# Altium schematic sheet ADS_ExG.SchDoc: ADS_ExG
size A; DrawnBy: Tai Le; Revision: Ver01
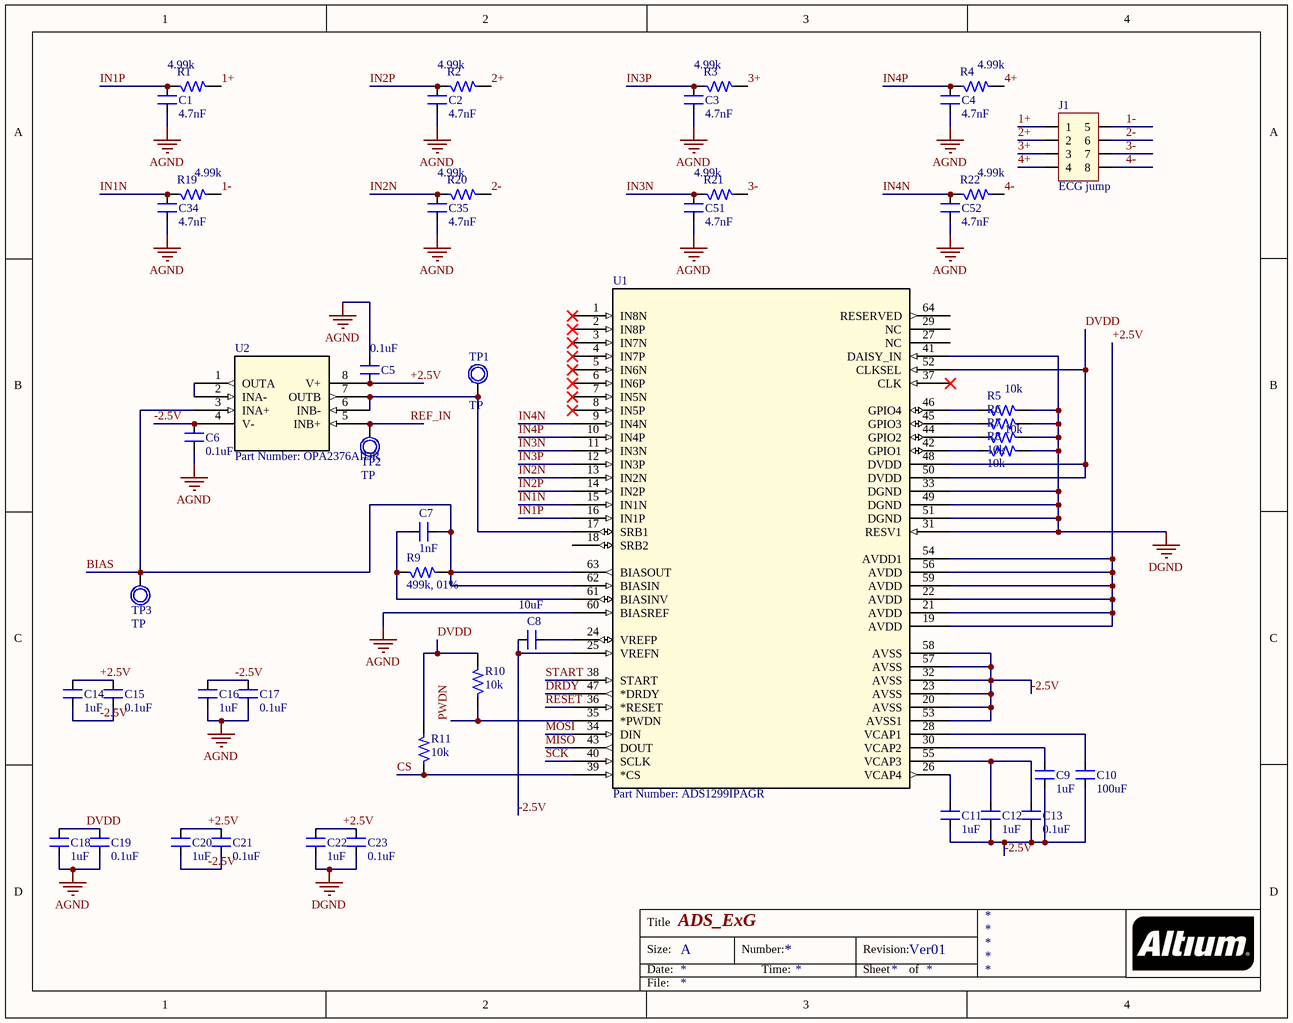
[diagram p0: ADS_ExG.SchDoc]

## Parts
C1  4.7nF  [SM-0805]
C2  4.7nF  [SM-0805]
C3  4.7nF  [SM-0805]
C4  4.7nF  [SM-0805]
C5  0.1uF  [SM-0805]
C6  0.1uF  [SM-0805]
C7  1nF  [SM-0805]
C8  10uF  [SM-0805]
C9  1uF  [SM-0805]
C10  100uF  [SM-0805]
C11  1uF  [SM-0805]
C12  1uF  [SM-0805]
C13  0.1uF  [SM-0805]
C14  1uF  [SM-0805]
C15  0.1uF  [SM-0805]
C16  1uF  [SM-0805]
C17  0.1uF  [SM-0805]
C18  1uF  [SM-0805]
C19  0.1uF  [SM-0805]
C20  1uF  [SM-0805]
C21  0.1uF  [SM-0805]
C22  1uF  [SM-0805]
C23  0.1uF  [SM-0805]
C34  4.7nF  [SM-0805]
C35  4.7nF  [SM-0805]
C51  4.7nF  [SM-0805]
C52  4.7nF  [SM-0805]
J1  ECG jump  [JP4x2]
R1  4.99k  [SM-0805]
R2  4.99k  [SM-0805]
R3  4.99k  [SM-0805]
R4  4.99k  [SM-0805]
R5  10k  [SM-0805]
R6  10k  [SM-0805]
R7  10k  [SM-0805]
R8  10k  [SM-0805]
R9  499k, 01%  [SM-0805]
R10  10k  [SM-0805]
R11  10k  [SM-0805]
R19  4.99k  [SM-0805]
R20  4.99k  [SM-0805]
R21  4.99k  [SM-0805]
R22  4.99k  [SM-0805]
TP1  TP  [TP1]
TP2  TP  [TP1]
TP3  TP  [TP1]
U1  Part Number: ADS1299IPAGR  [PAG64]
U2  Part Number: OPA2376AIDR  [D8]

## Nets
AGND: C1.1 C2.1 C3.1 C4.1 C5.2 C6.1 C16.1 C17.1 C18.1 C19.1 C34.1 C35.1 C51.1 C52.1 U1.60(BIASREF)
DGND: C22.1 C23.1 R5.2 R6.2 R7.2 R8.2 U1.31(RESV1) U1.33(DGND) U1.41(DAISY_IN) U1.49(DGND) U1.51(DGND)
1+: J1.1 R1.2
1-: J1.5 R19.2
2+: J1.2 R2.2
2-: J1.6 R20.2
3+: J1.3 R3.2
3-: J1.7 R21.2
4+: J1.4 R4.2
4-: J1.8 R22.2
+2.5V: C5.1 C14.2 C15.2 C20.2 C21.2 C22.2 C23.2 U1.19(AVDD) U1.21(AVDD) U1.22(AVDD) U1.54(AVDD1) U1.56(AVDD) U1.59(AVDD) U2.8(V+)
-2.5V: C6.2 C8.2 C9.1 C10.2 C11.1 C12.1 C13.1 C14.1 C15.1 C16.2 C17.2 C20.1 C21.1 U1.20(AVSS) U1.23(AVSS) U1.25(VREFN) U1.32(AVSS) U1.53(AVSS1) U1.57(AVSS) U1.58(AVSS) U2.4(V-)
BIAS: C7.2 R9.2 TP3.1 U1.62(BIASIN) U1.63(BIASOUT) U2.3(INA+)
CS: R11.1 U1.39(*CS)
DRDY: U1.47(*DRDY)
DVDD: C18.2 C19.2 R10.2 R11.2 U1.48(DVDD) U1.50(DVDD) U1.52(CLKSEL)
IN1N: C34.2 R19.1 U1.15(IN1N)
IN1P: C1.2 R1.1 U1.16(IN1P)
IN2N: C35.2 R20.1 U1.13(IN2N)
IN2P: C2.2 R2.1 U1.14(IN2P)
IN3N: C51.2 R21.1 U1.11(IN3N)
IN3P: C3.2 R3.1 U1.12(IN3P)
IN4N: C52.2 R22.1 U1.9(IN4N)
IN4P: C4.2 R4.1 U1.10(IN4P)
MISO: U1.43(DOUT)
MOSI: U1.34(DIN)
PWDN: R10.1 U1.35(*PWDN)
REF_IN: TP2.1 U2.5(INB+)
RESET: U1.36(*RESET)
SCK: U1.40(SCLK)
START: U1.38(START)
NetC7_1: C7.1 R9.1 U1.61(BIASINV)
NetC8_1: C8.1 U1.24(VREFP)
NetC9_2: C9.2 U1.30(VCAP2)
NetC10_1: C10.1 U1.28(VCAP1)
NetC11_2: C11.2 U1.26(VCAP4)
NetC12_2: C12.2 C13.2 U1.55(VCAP3)
NetR5_1: R5.1 U1.46(GPIO4)
NetR6_1: R6.1 U1.45(GPIO3)
NetR7_1: R7.1 U1.44(GPIO2)
NetR8_1: R8.1 U1.42(GPIO1)
NetTP1_1: TP1.1 U1.17(SRB1) U2.6(INB-) U2.7(OUTB)
NetU2_1: U2.1(OUTA) U2.2(INA-)

Not connected (* = marked no-connect by the designer): U1 1(IN8N)* 2(IN8P)* 3(IN7N)* 4(IN7P)* 5(IN6N)* 6(IN6P)* 7(IN5N)* 8(IN5P)* 18(SRB2) 27(NC) 29(NC) 37(CLK)* 64(RESERVED)

## Notes on the sheet
- Title
- Size:
- Date:
- A
- Number:
- Time:
- Revision:
- Sheet
- of
- File:

## Library data of the parts
C1-C23 C34 C35 C51 C52 = CM: Cap SMD; Value: 103
J1 = JP4x2: Connector 4x2; Value: Connector 4x2
R1-R11 R19-R22 = R: Resistor 1/4W; Value: R1/4W - 1K
TP1-TP3 = TP1: Test Point; Value: Test Point
U1 = ADS1299IPAGR: No Description Available; Vendor: Texas Instruments; Built_By: EMA_UL_Team; Manufacturer_Part_Number: ADS1299IPAGR; Copyright: Copyright (C) 2018 Accelerated Designs. All rights reserved; RefDes: RefDes; Type: DEV; Value: Value
U2 = OPA2376AIDR: No Description Available; Vendor: Texas Instruments; Built_By: EMA_UL_Team; Manufacturer_Part_Number: OPA2376AIDR; Copyright: Copyright (C) 2018 Accelerated Designs. All rights reserved; RefDes: RefDes; Type: DEV; Value: Value